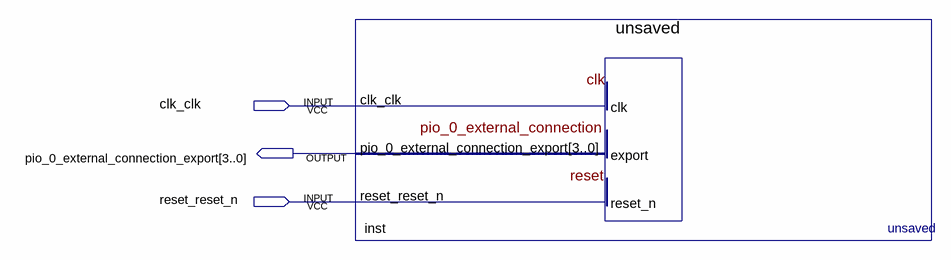
[diagram p0: schematic sheet]
// Quartus schematic nios.bdf as structural Verilog: 1 symbols, 3 pins
module nios (
  input  clk_clk,
  input  reset_reset_n,
  output [3:0] pio_0_external_connection_export
);

  unsaved inst (
    .clk_clk(clk_clk), .reset_reset_n(reset_reset_n),
    .pio_0_external_connection_export(pio_0_external_connection_export));
endmodule
